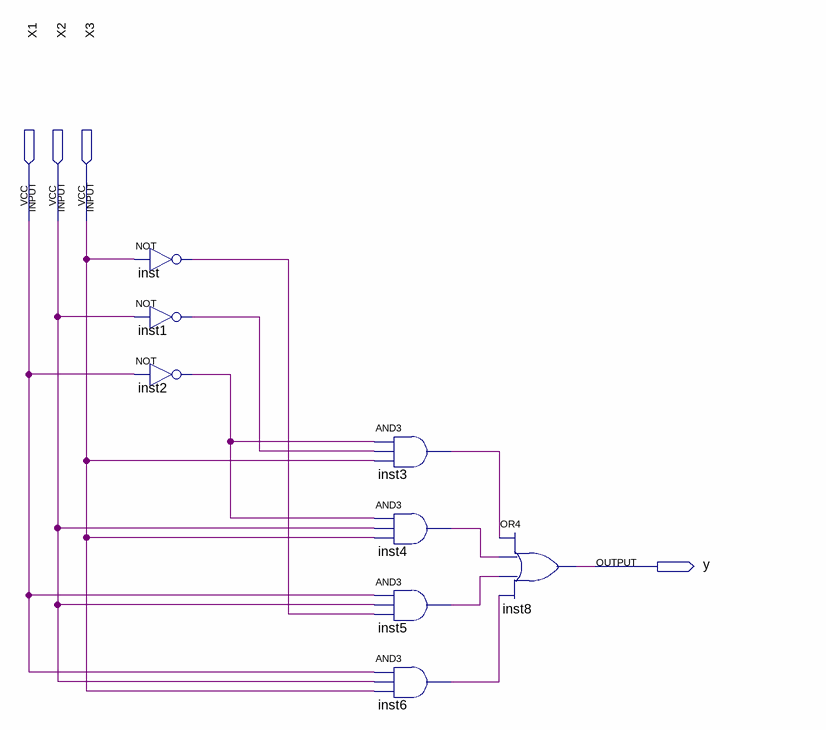
[diagram p0: schematic sheet]
// Quartus schematic scheme1.bdf as structural Verilog: 8 symbols, 4 pins
module scheme1 (
  input  X1,
  input  X2,
  input  X3,
  output y
);

  wire inst1_out, inst2_out, inst3_out, inst4_out, inst5_out, inst6_out, inst_out;

  not inst (inst_out, X3);
  not inst1 (inst1_out, X2);
  not inst2 (inst2_out, X1);
  and inst3 (inst3_out, inst2_out, inst1_out, X3);
  and inst4 (inst4_out, inst2_out, X2, X3);
  and inst5 (inst5_out, X1, X2, inst_out);
  and inst6 (inst6_out, X1, X2, X3);
  or inst8 (y, inst3_out, inst4_out, inst5_out, inst6_out);
endmodule
